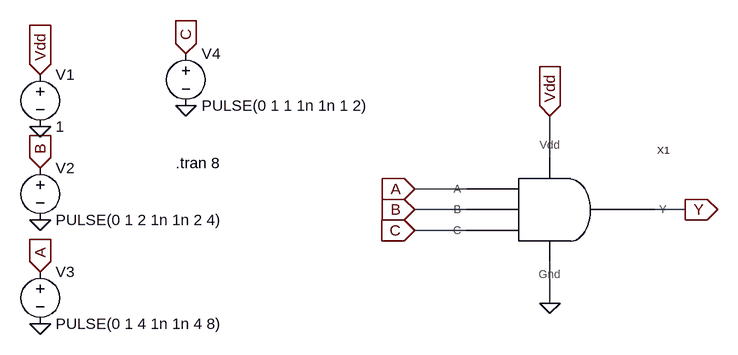
[diagram p0: schematic 3iAND_Test.asc]
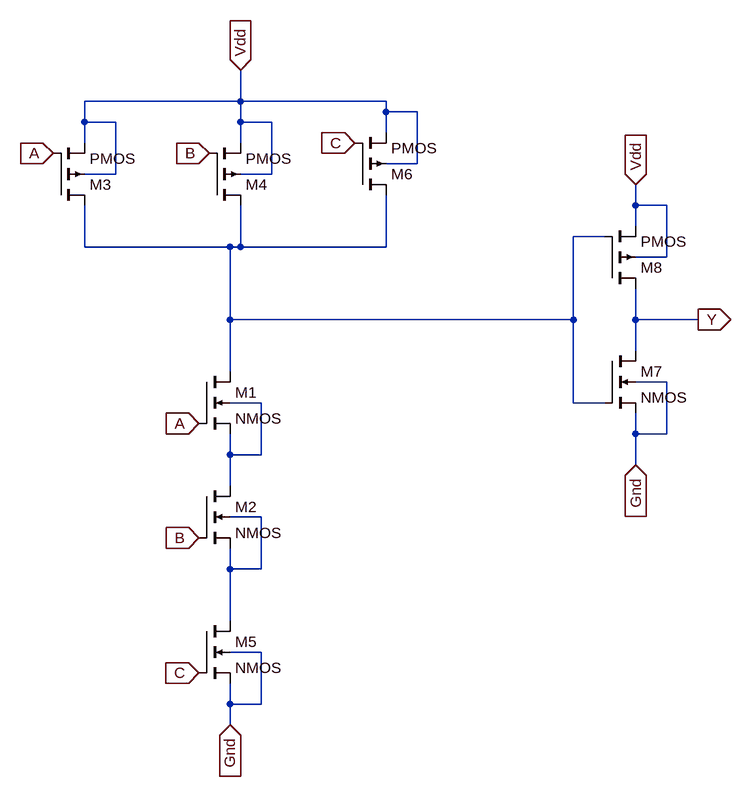
[diagram p1: sub-circuit 3iand.asc]
3iAND_Test.asc, the LTspice schematic file:
Version 4
SHEET 1 880 680
WIRE 352 80 352 16
WIRE 224 128 144 128
WIRE 224 160 144 160
WIRE 560 160 512 160
WIRE 224 192 144 192
WIRE 352 304 352 240
FLAG -432 -48 Vdd
IOPIN -432 -48 In
FLAG -432 96 B
IOPIN -432 96 In
FLAG -432 256 A
IOPIN -432 256 In
FLAG -432 32 0
FLAG -432 176 0
FLAG -432 336 0
FLAG -208 -80 C
IOPIN -208 -80 In
FLAG -208 0 0
FLAG 144 128 A
IOPIN 144 128 In
FLAG 144 160 B
IOPIN 144 160 In
FLAG 144 192 C
IOPIN 144 192 In
FLAG 352 16 Vdd
IOPIN 352 16 In
FLAG 560 160 Y
IOPIN 560 160 Out
FLAG 352 304 0
SYMBOL 3iAND 352 144 R0
SYMATTR InstName X1
SYMBOL voltage -432 -64 R0
SYMATTR InstName V1
SYMATTR Value 1
SYMBOL voltage -432 80 R0
WINDOW 123 0 0 Left 0
WINDOW 39 0 0 Left 0
SYMATTR InstName V2
SYMATTR Value PULSE(0 1 2 1n 1n 2 4)
SYMBOL voltage -432 240 R0
WINDOW 123 0 0 Left 0
WINDOW 39 0 0 Left 0
SYMATTR InstName V3
SYMATTR Value PULSE(0 1 4 1n 1n 4 8)
SYMBOL voltage -208 -96 R0
WINDOW 123 0 0 Left 0
WINDOW 39 0 0 Left 0
SYMATTR InstName V4
SYMATTR Value PULSE(0 1 1 1n 1n 1 2)
TEXT -224 88 Left 2 !.tran 8

3iand.asc, the sub-circuit schematic file:
Version 4
SHEET 1 1036 936
WIRE 240 -128 240 -176
WIRE 240 -128 0 -128
WIRE 464 -128 240 -128
WIRE 464 -112 464 -128
WIRE 512 -112 464 -112
WIRE 0 -96 0 -128
WIRE 48 -96 0 -96
WIRE 240 -96 240 -128
WIRE 288 -96 240 -96
WIRE 464 -80 464 -112
WIRE 0 -64 0 -96
WIRE 240 -64 240 -96
WIRE 512 -32 512 -112
WIRE 512 -32 464 -32
WIRE 48 -16 48 -96
WIRE 48 -16 0 -16
WIRE 288 -16 288 -96
WIRE 288 -16 240 -16
WIRE 848 32 848 0
WIRE 896 32 848 32
WIRE 848 64 848 32
WIRE 800 80 752 80
WIRE 0 96 0 32
WIRE 224 96 0 96
WIRE 240 96 240 32
WIRE 240 96 224 96
WIRE 464 96 464 16
WIRE 464 96 240 96
WIRE 896 112 896 32
WIRE 896 112 848 112
WIRE 224 208 224 96
WIRE 752 208 752 80
WIRE 752 208 224 208
WIRE 848 208 848 160
WIRE 944 208 848 208
WIRE 848 256 848 208
WIRE 224 288 224 208
WIRE 896 304 848 304
WIRE 272 336 224 336
WIRE 752 336 752 208
WIRE 800 336 752 336
WIRE 848 384 848 352
WIRE 896 384 896 304
WIRE 896 384 848 384
WIRE 224 416 224 384
WIRE 272 416 272 336
WIRE 272 416 224 416
WIRE 848 432 848 384
WIRE 224 464 224 416
WIRE 272 512 224 512
WIRE 224 592 224 560
WIRE 272 592 272 512
WIRE 272 592 224 592
WIRE 224 672 224 592
WIRE 272 720 224 720
WIRE 224 800 224 768
WIRE 272 800 272 720
WIRE 272 800 224 800
WIRE 224 832 224 800
FLAG 176 544 B
IOPIN 176 544 In
FLAG 176 368 A
IOPIN 176 368 In
FLAG -48 -48 A
IOPIN -48 -48 In
FLAG 192 -48 B
IOPIN 192 -48 In
FLAG 240 -176 Vdd
IOPIN 240 -176 In
FLAG 176 752 C
IOPIN 176 752 In
FLAG 416 -64 C
IOPIN 416 -64 In
FLAG 224 832 Gnd
IOPIN 224 832 In
FLAG 848 0 Vdd
IOPIN 848 0 In
FLAG 848 432 Gnd
IOPIN 848 432 In
FLAG 944 208 Y
IOPIN 944 208 Out
SYMBOL nmos4 176 288 R0
SYMATTR InstName M1
SYMBOL nmos4 176 464 R0
SYMATTR InstName M2
SYMBOL pmos4 -48 32 M180
SYMATTR InstName M3
SYMBOL pmos4 192 32 M180
SYMATTR InstName M4
SYMBOL nmos4 176 672 R0
SYMATTR InstName M5
SYMBOL pmos4 416 16 M180
SYMATTR InstName M6
SYMBOL nmos4 800 256 R0
SYMATTR InstName M7
SYMBOL pmos4 800 160 M180
SYMATTR InstName M8

The netlist it stands for:
* 3iAND_Test.asc
XX1 A B C Vdd 0 Y 3iand
V1 Vdd 0 1
V2 B 0 PULSE(0 1 2 1n 1n 2 4)
V3 A 0 PULSE(0 1 4 1n 1n 4 8)
V4 C 0 PULSE(0 1 1 1n 1n 1 2)

* block symbol definitions
.subckt 3iand A B C Vdd Gnd Y
M1 N001 A N002 N002 NMOS
M2 N002 B N003 N003 NMOS
M3 N001 A Vdd Vdd PMOS
M4 N001 B Vdd Vdd PMOS
M5 N003 C Gnd Gnd NMOS
M6 N001 C Vdd Vdd PMOS
M7 Y N001 Gnd Gnd NMOS
M8 Y N001 Vdd Vdd PMOS
.ends 3iand

.model NMOS NMOS
.model PMOS PMOS
.lib standard.mos
.tran 8
.backanno
.end

* Results of the author's LTspice run, read from the files saved beside the schematic
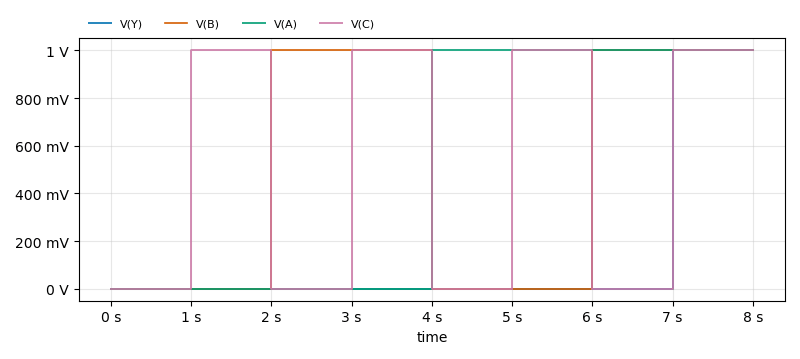
[diagram p2: Transient Analysis of 3iAND_Test.asc, plotted from the saved traces]
* Transient Analysis, 1 run:
*   V(Y): min 100.5 nV, max 1 V, average 125 mV, rms 353.6 mV, last 1 V
*   V(B): min 0 V, max 1 V, average 500 mV, rms 707.1 mV, last 1 V
*   V(A): min 0 V, max 1 V, average 500 mV, rms 707.1 mV, last 1 V
*   V(C): min 0 V, max 1 V, average 500 mV, rms 707.1 mV, last 1 V